# EAGLE design TIEVOX Interface for Case (EAGLE 7.4.0)
Basic interface to card. Including audio outputs. Includes connectors for accessory relay and power conversion.
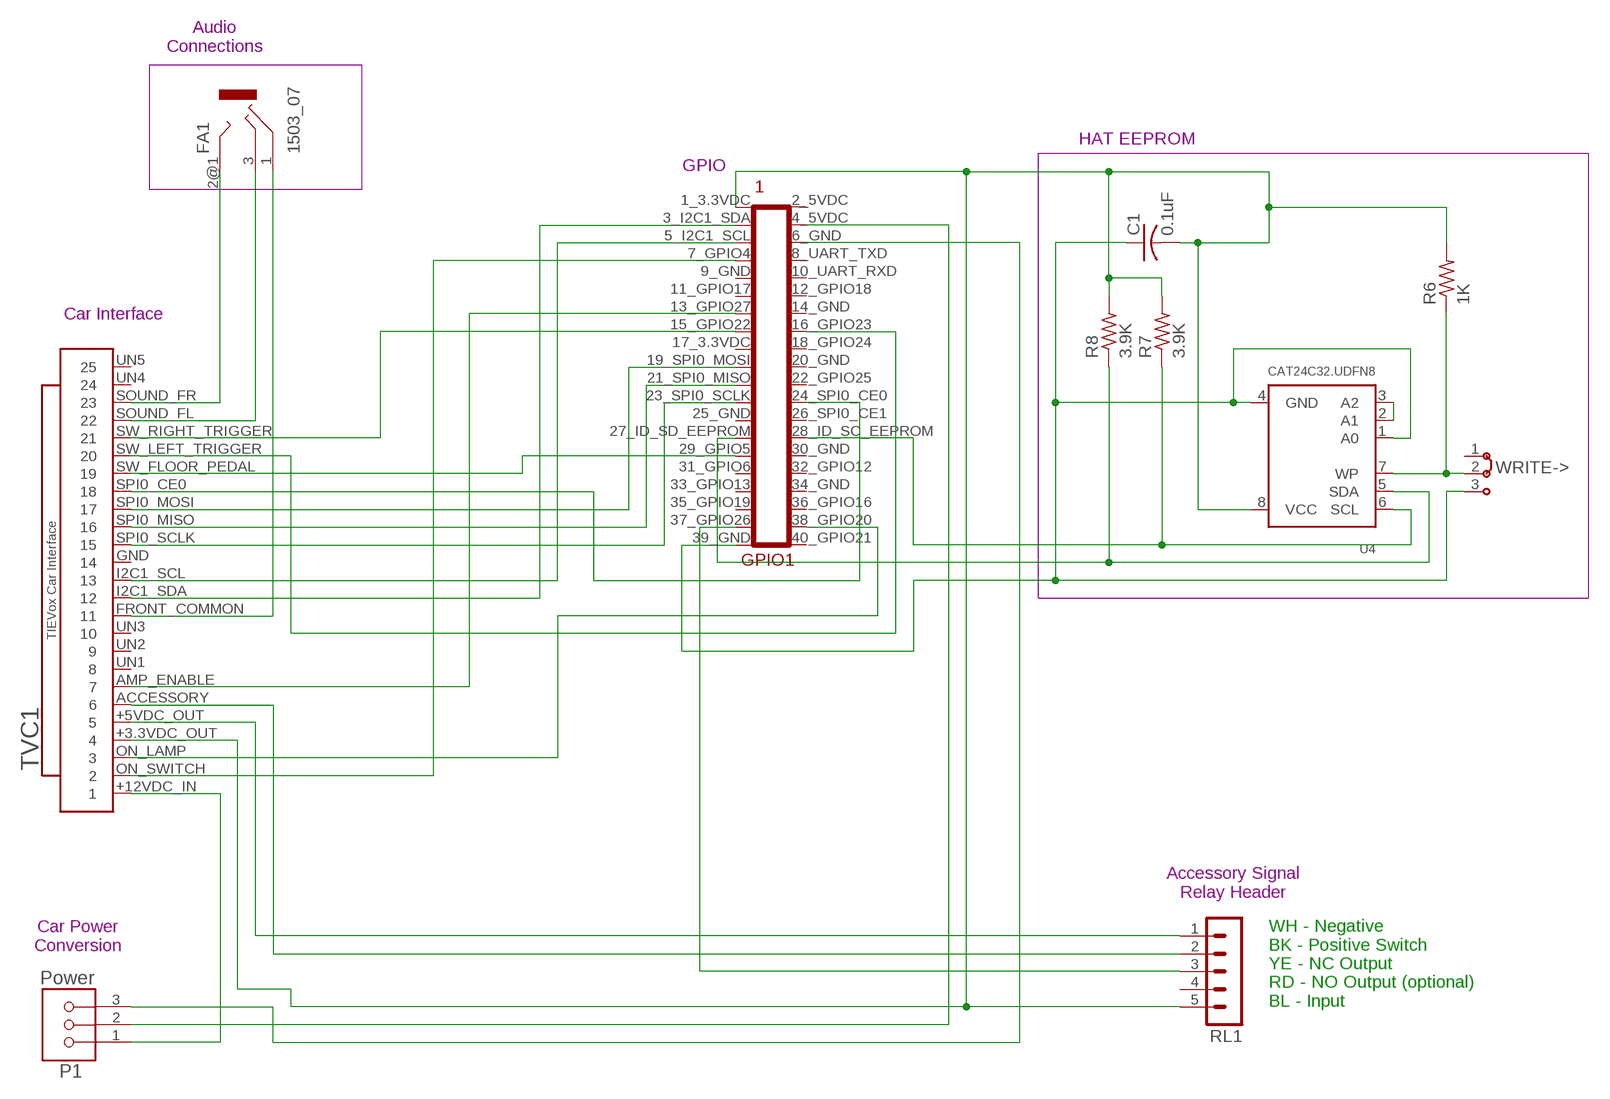
[diagram p0: schematic, sheet 1]

## Parts
C1  0.1uF  C-US025-050X050  [C025-050X050]
FA1  1503_07  [1503_07]
GPIO1  RPI_GPIO_MALE_SHROUD  [RPI_GPIO_MALE]
P1  Power  CONN3-L  [PINHEAD-LOCK-3]
R6  1K  R-US_0207/10  [0207/10]
R7  3.9K  R-US_0207/10  [0207/10]
R8  3.9K  R-US_0207/10  [0207/10]
RL1  MA05-1  [MA05-1]
TVC1  TIEVox Car Interface  TIEVOX_CAR_25  [D-SUB25]
U4  CAT24C32.UDFN8  EEPROM_I2C_SOIC8_GENERIC  [SOIC8_150MIL]
WRITE->  J2X2MM  [04C]

## Nets
+3.3VDC: C1.2 GPIO1.1_3.3VDC R6.2 R7.2 R8.2 RL1.5 TVC1.+3.3VDC_OUT U4.8(VCC)
+5VDC: GPIO1.4_5VDC P1.2 TVC1.+5VDC_OUT
GND: GPIO1.6_GND P1.3 RL1.1
GND_39: C1.1 GPIO1.39_GND U4.1(A0) U4.4(GND) WRITE->.3
N$1: U4.2(A1) U4.3(A2)
N$2: GPIO1.28_ID_SC_EEPROM R7.1 U4.6(SCL)
N$3: GPIO1.27_ID_SD_EEPROM(27_ID_SC_EEPROM) R8.1 U4.5(SDA)
N$5: FA1.1 TVC1.FRONT_COMMON
N$8: GPIO1.23_SPI0_SCLK TVC1.SPI0_SCLK
N$9: GPIO1.21_SPI0_MISO TVC1.SPI0_MISO
N$10: GPIO1.19_SPI0_MOSI TVC1.SPI0_MOSI
N$14: FA1.2@1 TVC1.SOUND_FR
N$15: FA1.3 TVC1.SOUND_FL
N$18: GPIO1.5_I2C1_SCL TVC1.I2C1_SCL
N$19: GPIO1.3_I2C1_SDA TVC1.I2C1_SDA
N$20: GPIO1.24_SPI0_CE0 TVC1.SPI0_CE0
N$21: RL1.2 TVC1.ACCESSORY
N$23: GPIO1.13_GPIO27 TVC1.AMP_ENABLE
N$24: GPIO1.7_GPIO4 TVC1.ON_SWITCH
N$25: GPIO1.38_GPIO20 TVC1.ON_LAMP
N$26: GPIO1.29_GPIO5 TVC1.SW_FLOOR_PEDAL
N$27: GPIO1.15_GPIO22 TVC1.SW_RIGHT_TRIGGER
N$30: GPIO1.16_GPIO23 TVC1.SW_LEFT_TRIGGER
N$31: GPIO1.37_GPIO26 RL1.3
N$39: R6.1 U4.7(WP) WRITE->.2
PWR12_IN: P1.1 TVC1.+12VDC_IN
Unconnected: FA1.2@2 GPIO1.8_UART_TXD(8_UART0_TXD) GPIO1.10_UART_RXD(10_UART0_RXD) GPIO1.11_GPIO17 GPIO1.12_GPIO18 GPIO1.18_GPIO24 GPIO1.22_GPIO25 GPIO1.26_SPI0_CE1 GPIO1.31_GPIO6 GPIO1.32_GPIO12 GPIO1.33_GPIO13 GPIO1.35_GPIO19 GPIO1.36_GPIO16 GPIO1.40_GPIO21 RL1.4 TVC1.GND TVC1.UN1 TVC1.UN2 TVC1.UN3 TVC1.UN4 TVC1.UN5 WRITE->.1

## Notes on the sheet
- Audio
  Connections
- HAT EEPROM
- GPIO
- Car Interface
- Accessory Signal
  Relay Header
- Car Power
  Conversion
- WH - Negative
  BK - Positive Switch
  YE - NC Output
  RD - NO Output (optional)
  BL - Input

## Power pins joined to a net without a drawn wire
2_5VDC: GPIO1.2_5VDC
9_GND: GPIO1.9_GND
14_GND: GPIO1.14_GND
17_3.3VDC: GPIO1.17_3.3VDC
20_GND: GPIO1.20_GND
25_GND: GPIO1.25_GND
30_GND: GPIO1.30_GND
34_GND: GPIO1.34_GND

## Library data of the parts
C1 = adafruit:C-US: CAPACITOR, American symbol
FA1 = con-lumberg:1503_?: Jack connectors according to JISC 6560, 3.5 mm Klinkensteckverbinder nach JISC 6560, 3,5 mm Source: http://www.lumberg.com/Produkte/PDFs/1503_08.pdf; OC_FARNELL: unknown; OC_NEWARK: unknown
GPIO1 = connectors:RPI_GPIO*: GPIO Connector for Raspberry Pi.
P1 = connector:CONN3-L: 3 pin connector, unspecified; DESC: Header, 3 pin locking; MANUF: Molex; PARTNUM: 22-23-2031; SUPPLIER: Mouser:538-22-23-2031; VALSTAT: label
R6-R8 = adafruit:R-US_: RESISTOR, American symbol
RL1 = con-lstb:MA05-1: PIN HEADER; OC_FARNELL: unknown; OC_NEWARK: unknown
TVC1 = connectors:TIEVOX_CAR_25: TIEVox Car Interface Based on a D-SUB 25 conncection. A male version has to be built into the car as well.
U4 = microbuilder:EEPROM_I2C_SOIC8_GENERIC: Note: The same pinout is used for many I2C EEPROMs in SOIC8(150mil) from a variety of manufacturers and in various sizes. Examples: 16K (2K x 8 Bit) I2C EEPROM 1.7-5.5V, 400KHz, -40°C-85°C Digikey: CAT24C16WI-GT3CT-ND 256K (32K x 8 Bit) I2C EEPROM 1.7-5.5V, 400KHz, -40°C-85°C Digikey: 24AA256-I/SN-ND
WRITE-> = jumper:J2: Jumper switch 2 x 2.5 mm

## Board
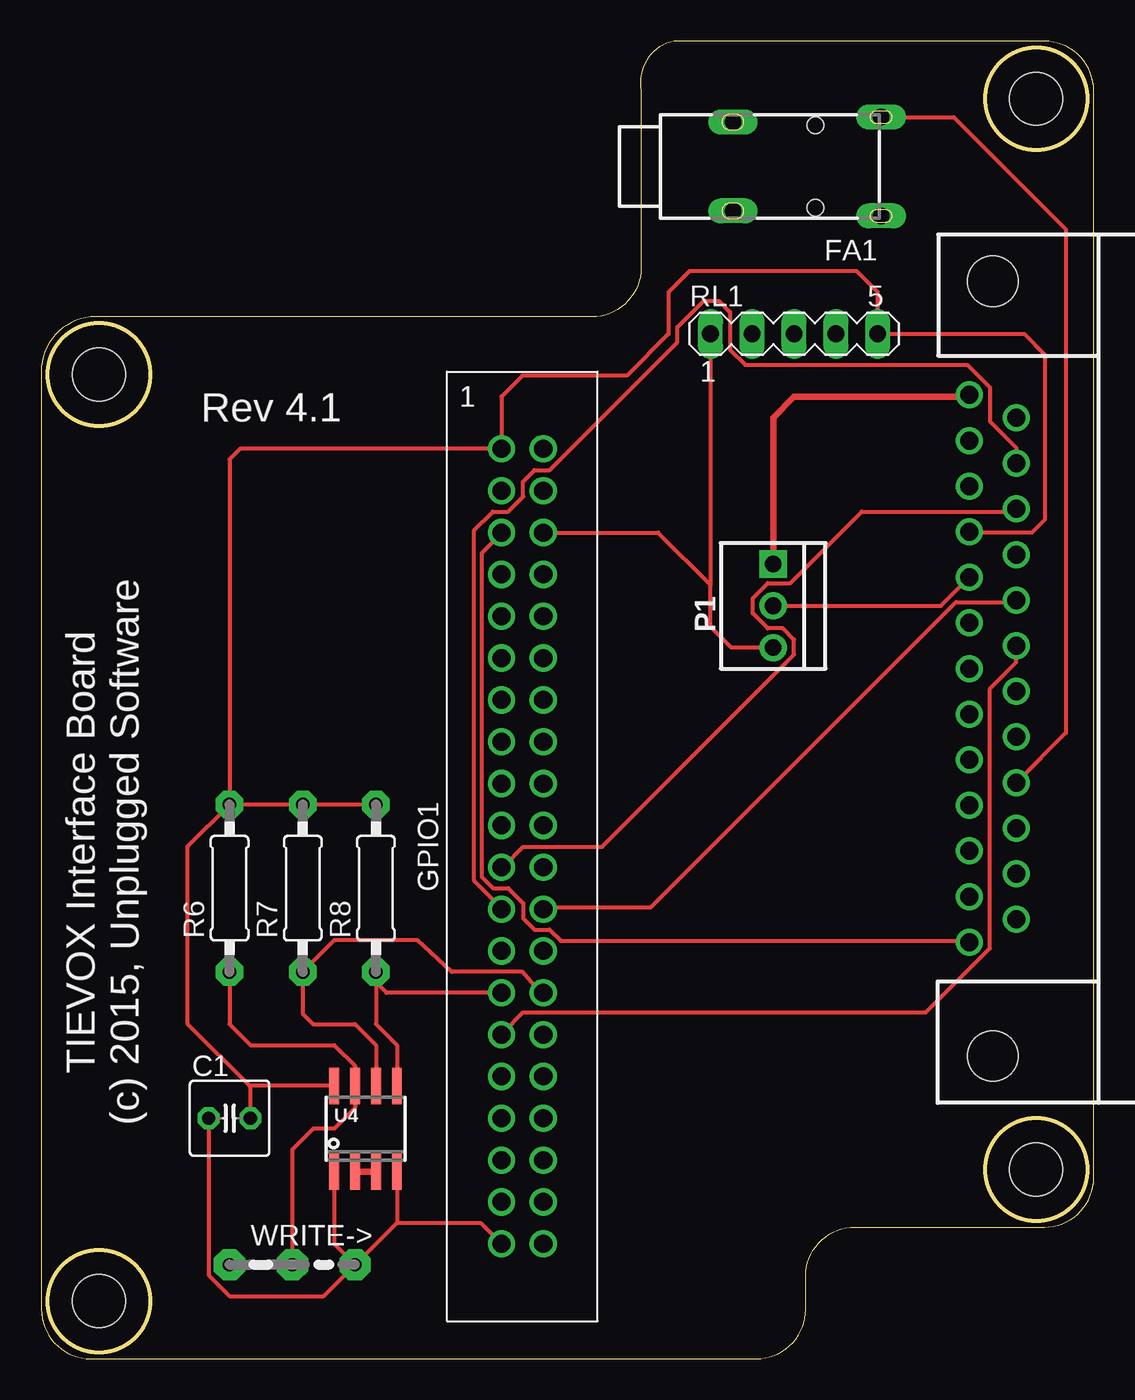
[diagram p1: board, top side]
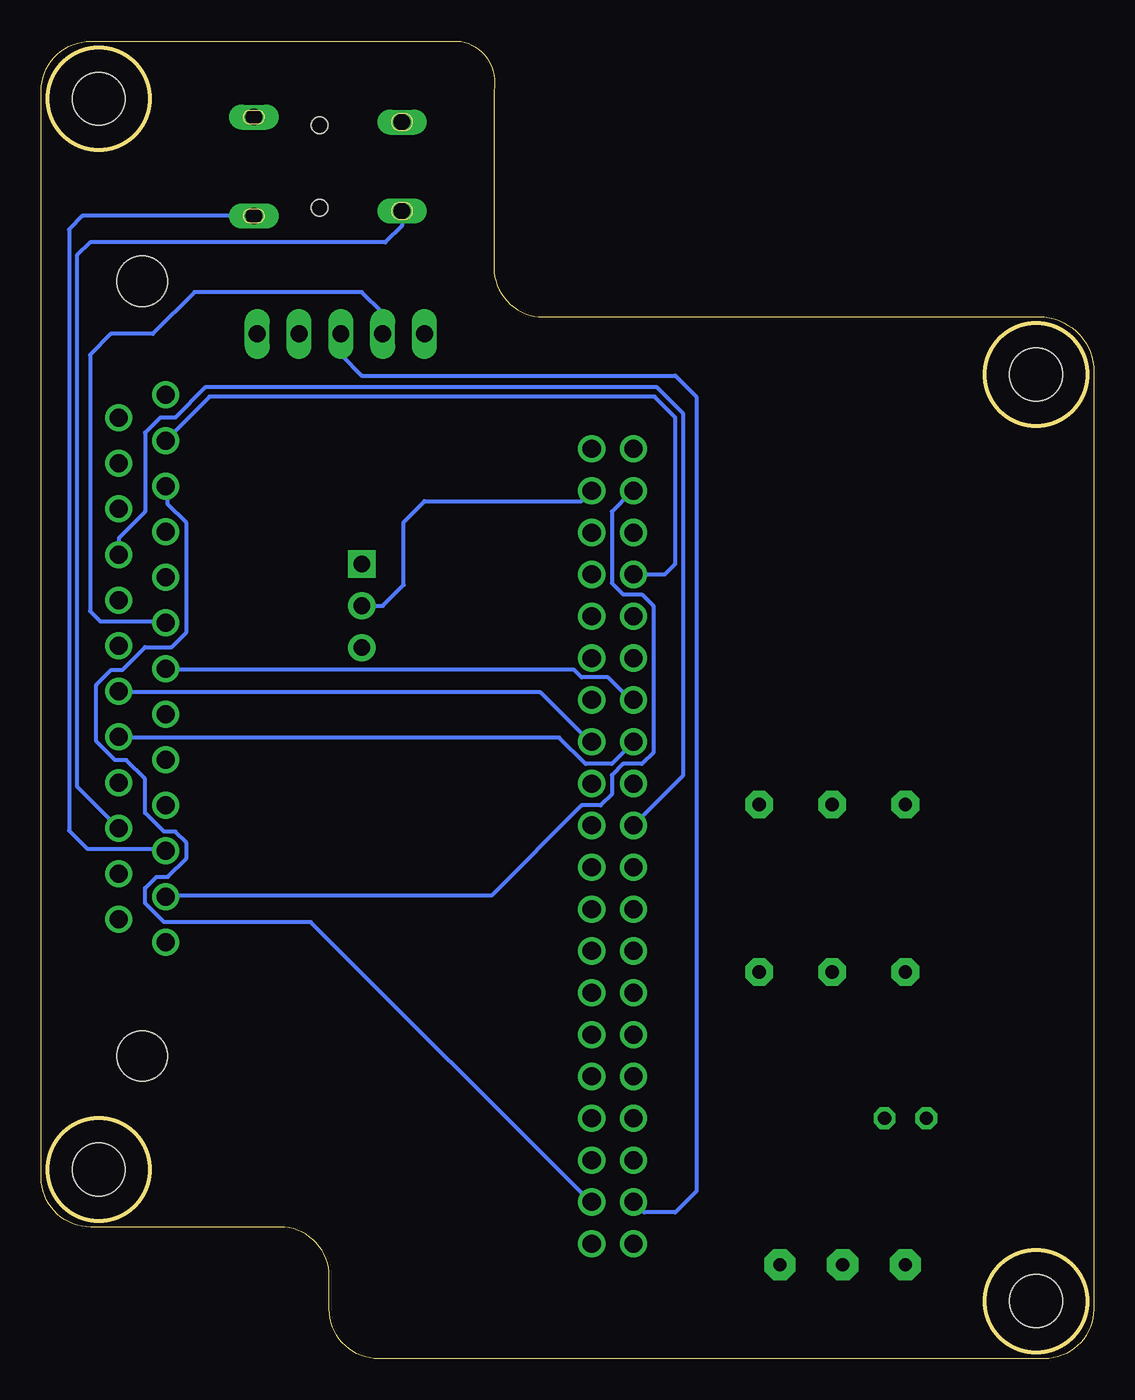
[diagram p2: board, bottom side, seen from below]

Size 63.94 x 80 mm. Coordinates in mm from the lower left corner, seen from the top.
Outline: 0.02,3 arc90 3.02,0 43.44,0 arc90 46.44,3 46.44,5 arc-90 49.44,8 60.94,8 arc90 63.94,11 63.94,77 arc90 60.94,80 38.44,80 arc90 36.44,77 36.44,66.25 arc-90 33.44,63.26 3.02,63.26 arc90 0.02,59.62 0.02,3
Outline: circle at 3.52,3.5 radius 3.1
Outline: circle at 3.52,59.76 radius 3.1
Outline: circle at 60.44,76.5 radius 3.1
Outline: circle at 60.44,11.5 radius 3.1
Copper layers (1*16): Top 0.035mm / dielectric 1.5mm / Bottom 0.035mm
Design rules "default": minimum track width 10mil, minimum drill 24mil, track to track 8mil, track to pad 8mil, pad to pad 8mil, via to via 8mil, smd to smd 8mil, copper to edge 40mil, drill to drill 8mil, minimum pad ring 10mil, minimum via ring 8mil, stop-mask expansion 4mil, vias tented up to drill 0mil, thermal gap 10mil
Holes 3.2 mm at 3.52,3.5 60.44,76.5 3.52,59.76 60.44,11.5

### Footprints (pad centres in the part's own frame; a part is rotated, then mirrored left to right if it is on the bottom)
C025-050X050 = drill 0.813 octagon: 1 -1.27,0; 2 1.27,0
1503_07 = drill 1 pad 1.2 long: 1 -3,-11; 2@1 -2.7,-2; 2@2 2.7,-2; 3 3,-11 | hole 1: -2.5,-7; 2.5,-7
RPI_GPIO_MALE = drill 1.1: 1_3.3VDC -1.27,24.13; 2_5VDC 1.27,24.13; 3_I2C1_SDA -1.27,21.59; 4_5VDC 1.27,21.59; 5_I2C1_SCL -1.27,19.05; 6_GND 1.27,19.05; 7_GPIO4 -1.27,16.51; 8_UART_TXD 1.27,16.51; 9_GND -1.27,13.97; 10_UART_RXD 1.27,13.97; 11_GPIO17 -1.27,11.43; 12_GPIO18 1.27,11.43; 13_GPIO27 -1.27,8.89; 14_GND 1.27,8.89; 15_GPIO22 -1.27,6.35; 16_GPIO23 1.27,6.35; 17_3.3VDC -1.27,3.81; 18_GPIO24 1.27,3.81; 19_SPI0_MOSI -1.27,1.27; 20_GND 1.27,1.27; 21_SPI0_MISO -1.27,-1.27; 22_GPIO25 1.27,-1.27; 23_SPI0_SCLK -1.27,-3.81; 24_SPI0_CE0 1.27,-3.81; 25_GND -1.27,-6.35; 26_SPI0_CE1 1.27,-6.35; 27_ID_SD_EEPROM -1.27,-8.89; 28_ID_SC_EEPROM 1.27,-8.89; 29_GPIO5 -1.27,-11.43; 30_GND 1.27,-11.43; 31_GPIO6 -1.27,-13.97; 32_GPIO12 1.27,-13.97; 33_GPIO13 -1.27,-16.51; 34_GND 1.27,-16.51; 35_GPIO19 -1.27,-19.05; 36_GPIO16 1.27,-19.05; 37_GPIO26 -1.27,-21.59; 38_GPIO20 1.27,-21.59; 39_GND -1.27,-24.13; 40_GPIO21 1.27,-24.13
PINHEAD-LOCK-3 = drill 1.016 pad 1.651 square: 1 2.54,0 | drill 1.016 pad 1.651: 2 0,0; 3 -2.54,0
0207/10 = drill 0.813 pad 1.676 octagon: 1 -5.08,0; 2 5.08,0
MA05-1 = drill 1.016 long: 1 -5.08,0; 2 -2.54,0; 3 0,0; 4 2.54,0; 5 5.08,0
D-SUB25 = drill 1.092: +3.3VDC_OUT 8.306,1.422; +5VDC_OUT 5.537,1.422; +12VDC_IN 16.612,1.422; ACCESSORY 2.769,1.422; AMP_ENABLE 0,1.422; FRONT_COMMON -11.074,1.422; GND 15.227,-1.422; I2C1_SCL -16.612,1.422; I2C1_SDA -13.843,1.422; ON_LAMP 11.074,1.422; ON_SWITCH 13.843,1.422; SOUND_FL -6.921,-1.422; SOUND_FR -9.69,-1.422; SPI0_CE0 4.153,-1.422; SPI0_MISO 9.69,-1.422; SPI0_MOSI 6.921,-1.422; SPI0_SCLK 12.459,-1.422; SW_FLOOR_PEDAL 1.384,-1.422; SW_LEFT_TRIGGER -1.384,-1.422; SW_RIGHT_TRIGGER -4.153,-1.422; UN1 -8.306,1.422; UN2 -5.537,1.422; UN3 -2.769,1.422; UN4 -12.459,-1.422; UN5 -15.227,-1.422 | hole 3.048: -23.52,0; 23.52,0
SOIC8_150MIL = smd 0.6 x 2.2: 1 -1.905,-2.6; 2 -0.635,-2.6; 3 0.635,-2.6; 4 1.905,-2.6; 5 1.905,2.6; 6 0.635,2.6; 7 -0.635,2.6; 8 -1.905,2.6
04C = drill 0.813 pad 1.905 octagon: 1 -1.905,0; 2 1.905,0; 3 5.715,0

### Placement (x,y rotation side)
C1  11.45,14.61 0 top
FA1  40.02,72.39 90 top
GPIO1  29.23,31.11 0 top
P1  44.47,45.72 90 top
R6  11.45,28.57 90 top
R7  15.89,28.57 90 top
R8  20.34,28.57 90 top
RL1  45.74,62.23 0 top
TVC1  57.8,41.91 90 top
U4  19.7,13.97 0 top
WRITE->  13.35,5.71 0 top

### Tracks (layer width: path | path; a pad name or v marks a point on that pad's centre or on a via)
+3.3VDC
  Top 0.254: R8.2 R7.2 R6.2 | U4.8 12.72,16.57 | 12.72,16.57 12.66,16.57 8.91,20.32 8.91,31.11 R6.2 | R6.2 11.45,54.61 12.08,55.24 GPIO1.1_3.3VDC 27.96,58.42 29.23,59.69 35.58,59.69 38.12,62.23 38.12,64.77 39.39,66.04 49.55,66.04 50.82,64.77 RL1.5 59.71,62.23 60.98,60.96 60.98,50.96 60.18,50.16 56.43,50.16 TVC1.+3.3VDC_OUT | C1.2 12.72,16.57
+5VDC
  Top 0.254: P1.2 54.65,45.72 TVC1.+5VDC_OUT
  Bottom 0.254: P1.2 43.2,45.72 41.93,46.99 41.93,50.8 40.66,52.07 31.13,52.07 GPIO1.4_5VDC
GND
  Top 0.254: RL1.1 40.66,46.99 | GPIO1.6_GND 37.48,50.16 40.66,46.99 | P1.3 41.93,43.18 40.66,44.45 40.66,46.99
GND_39
  Top 0.254: C1.1 10.18,5.08 11.45,3.81 17.16,3.81 WRITE->.3 | U4.1 17.8,6.99 WRITE->.3 | U4.4 21.61,8.26 | 21.61,8.26 WRITE->.3 | 21.61,8.26 26.69,8.26 GPIO1.39_GND
N$1
  Top 0.406: U4.3 U4.2
N$2
  Top 0.254: U4.6 20.34,19.05 19.07,20.32 16.53,20.32 15.89,20.95 R7.1 17.8,25.4 22.88,25.4 24.94,23.5 29.23,23.5 30.34,22.23 GPIO1.28_ID_SC_EEPROM
N$3
  Top 0.254: R8.1 20.34,22.86 | 20.34,22.86 20.34,20.32 21.61,19.05 U4.5 | GPIO1.27_ID_SD_EEPROM 20.97,22.23 20.34,22.86
N$5
  Bottom 0.254: FA1.1 61.44,69.39 62.25,68.58 62.25,32.07 61.13,30.96 56.5,30.96 TVC1.FRONT_COMMON
N$8
  Top 0.254: TVC1.SPI0_SCLK 59.22,55.32 57.62,56.92 57.62,58.98 56.25,60.35 42.76,60.35 41.85,61.27 41.85,63.55 41.16,64.24 40.25,64.24 38.65,62.64 38.65,61.72 30.88,53.95 29.96,53.95 29.28,53.26 29.28,52.35 28.36,51.44 27.45,51.44 26.3,50.29 26.3,29.03 27.9,27.43 GPIO1.23_SPI0_SCLK
N$9
  Top 0.254: TVC1.SPI0_MISO 59.22,51.44 49.85,51.44 45.51,47.09 44.14,47.09 43.22,46.18 43.22,45.26 44.14,44.35 45.05,44.35 45.74,43.66 45.74,42.75 34.08,31.09 29.28,31.09 28.13,29.95 GPIO1.21_SPI0_MISO
N$10
  Bottom 0.254: TVC1.SPI0_MOSI 59.22,49.84 57.62,51.44 57.62,56.24 56.71,57.15 55.79,57.15 53.97,58.98 26.53,58.98 24.93,57.38 24.93,35.43 27.9,32.46 GPIO1.19_SPI0_MOSI
N$14
  Bottom 0.254: FA1.2@1 42.02,68.8 43.04,67.79 60.98,67.79 61.77,66.99 61.77,34.77 TVC1.SOUND_FR
N$15
  Top 0.254: FA1.3 55.44,75.39 62.25,68.58 62.25,38.01 TVC1.SOUND_FL
N$18
  Top 0.254: TVC1.I2C1_SCL 56.25,25.38 31.56,25.38 30.88,26.06 29.96,26.06 29.28,26.75 29.28,27.66 28.36,28.57 27.45,28.57 26.76,29.26 26.76,48.92 27.9,50.06 GPIO1.5_I2C1_SCL
N$19
  Bottom 0.254: TVC1.I2C1_SDA 56.25,28.12 36.59,28.12 31.11,33.6 29.96,33.6 29.28,34.29 29.28,35.43 28.59,36.12 27.45,36.12 26.76,36.8 26.76,45.72 27.45,46.41 28.59,46.41 29.28,47.09 29.28,51.44 28.13,52.58 GPIO1.3_I2C1_SDA
N$20
  Top 0.254: TVC1.SPI0_CE0 59.22,45.95 55.57,45.95 37.05,27.43 30.65,27.43 GPIO1.24_SPI0_CE0
N$21
  Bottom 0.254: RL1.2 43.2,63.5 44.47,64.77 54.63,64.77 57.17,62.23 59.71,62.23 60.98,60.96 60.98,45.4 60.34,44.77 56.47,44.77 TVC1.ACCESSORY
N$23
  Bottom 0.254: TVC1.AMP_ENABLE 56.25,41.83 31.56,41.83 31.11,41.38 29.5,41.38 28.13,40.01 GPIO1.13_GPIO27
N$24
  Bottom 0.254: GPIO1.7_GPIO4 26.05,47.62 25.42,48.26 25.42,57.15 26.69,58.42 53.71,58.42 TVC1.ON_SWITCH
N$25
  Bottom 0.254: TVC1.ON_LAMP 56.25,52.81 56.25,51.89 55.11,50.75 55.11,44.12 56.02,43.2 57.62,43.2 58.99,41.83 59.68,41.83 60.59,40.92 60.59,37.49 59.45,36.35 58.77,36.35 57.62,35.2 57.62,33.15 56.48,32 55.79,32 55.11,31.32 55.11,30.4 56.25,29.26 56.94,29.26 57.62,28.57 57.62,27.66 56.48,26.52 47.56,26.52 30.65,9.6 GPIO1.38_GPIO20
N$26
  Top 0.254: TVC1.SW_FLOOR_PEDAL 59.22,42.29 57.62,40.69 57.62,24.92 53.74,21.03 29.28,21.03 28.13,19.89 GPIO1.29_GPIO5
N$27
  Bottom 0.254: TVC1.SW_RIGHT_TRIGGER 59.22,37.72 32.48,37.72 30.88,36.12 29.28,36.12 28.13,37.26 GPIO1.15_GPIO22
N$30
  Bottom 0.254: TVC1.SW_LEFT_TRIGGER 59.22,40.46 33.62,40.46 30.65,37.49 GPIO1.16_GPIO23
N$31
  Bottom 0.254: RL1.3 45.74,60.96 44.47,59.69 25.42,59.69 24.15,58.42 24.15,10.16 25.42,8.89 27.32,8.89 GPIO1.37_GPIO26
N$39
  Top 0.254: R6.1 11.45,20.32 12.72,19.05 17.8,19.05 19.07,17.78 U4.7 19.07,15.24 17.8,13.97 16.53,13.97 15.26,12.7 WRITE->.2
PWR12_IN
  Top 0.406: TVC1.+12VDC_IN 56.28,58.42 45.74,58.42 44.47,57.15 P1.1

### Text on the board
tNames: Rev 4.1 | TIEVOX Interface Board / (c) 2015, Unplugged Software